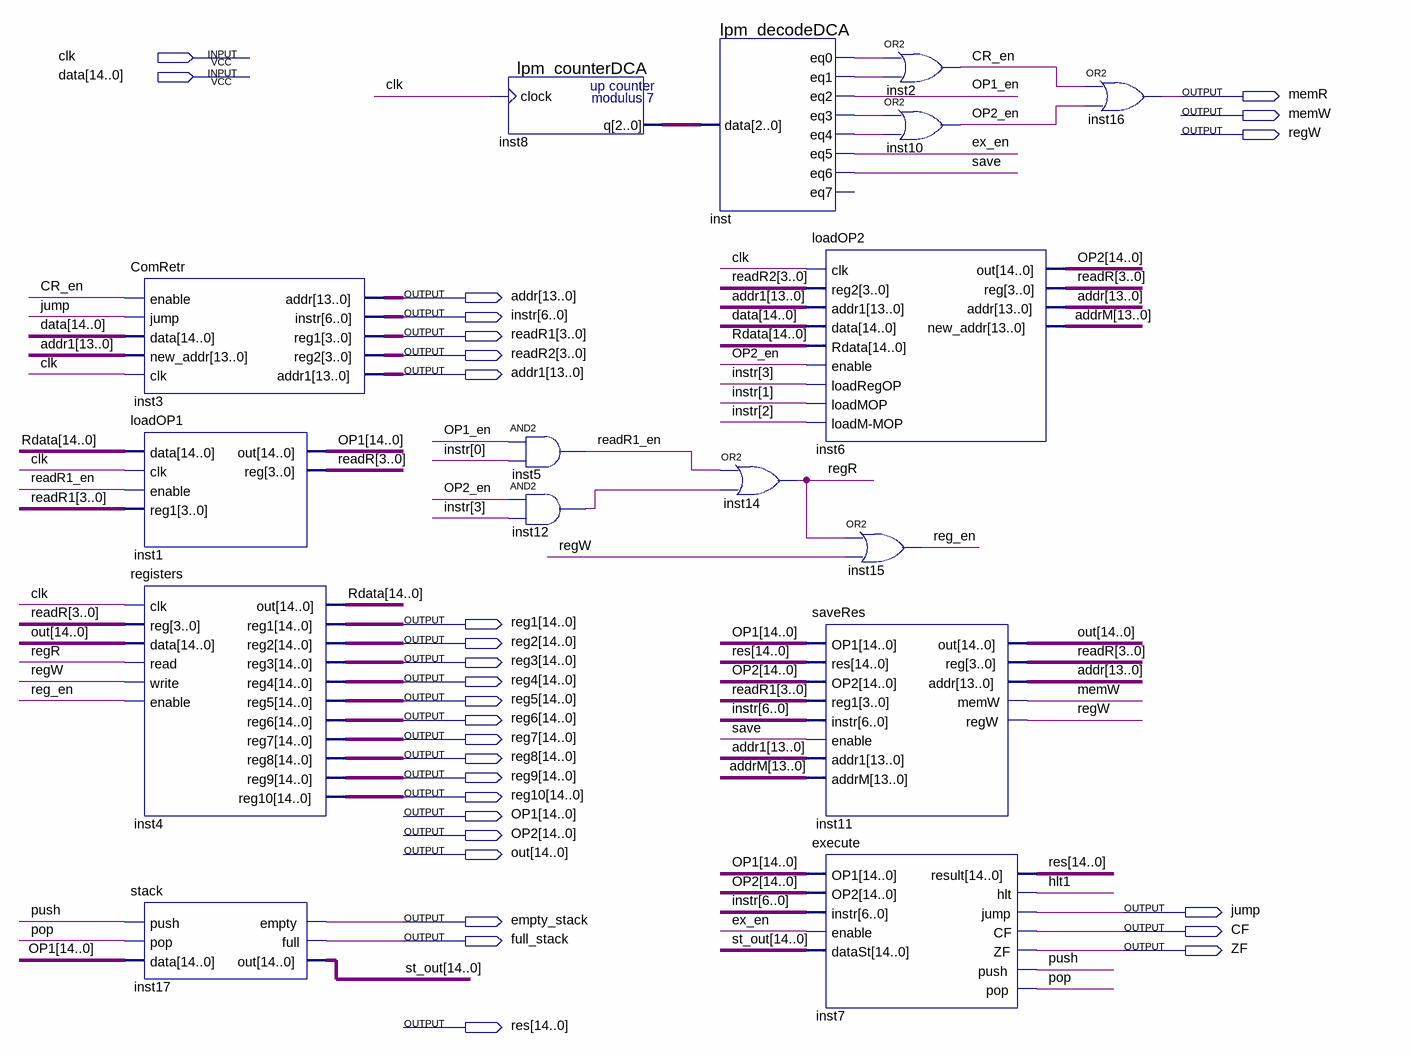
[diagram p0: schematic sheet]
// Quartus schematic cpu.bdf as structural Verilog: 16 symbols, 29 pins
module cpu (
  input  clk,
  input  [14:0] data,
  output memR,
  output memW,
  output regW,
  output [13:0] addr,
  output [6:0] instr,
  output [3:0] readR1,
  output [3:0] readR2,
  output [13:0] addr1,
  output [14:0] reg1,
  output [14:0] reg2,
  output [14:0] reg3,
  output [14:0] reg4,
  output [14:0] reg5,
  output [14:0] reg6,
  output [14:0] reg7,
  output [14:0] reg8,
  output [14:0] reg9,
  output [14:0] reg10,
  output [14:0] OP1,
  output [14:0] OP2,
  output [14:0] out,
  output jump,
  output empty_stack,
  output CF,
  output full_stack,
  output ZF,
  output [14:0] res
);

  wire CR_en, ex_en, hlt1, inst12_out, inst_eq0, inst_eq1, inst_eq3, inst_eq4, OP1_en, OP2_en, pop, push,
       readR1_en, reg_en, regR, save;
  wire [2:0] inst8_q;
  wire [3:0] readR;
  wire [13:0] addrM;
  wire [14:0] Rdata, st_out;

  ComRetr inst3 (
    .enable(CR_en), .jump(jump), .data(data), .new_addr(addr1), .clk(clk), .addr(addr), .instr(instr),
    .reg1(readR1), .reg2(readR2), .addr1(addr1));
  loadOP1 inst1 (.data(Rdata), .clk(clk), .enable(readR1_en), .reg1(readR1), .out(OP1), .\reg (readR));
  registers inst4 (
    .clk(clk), .\reg (readR), .data(out), .read(regR), .write(regW), .enable(reg_en), .out(Rdata),
    .reg1(reg1), .reg2(reg2), .reg3(reg3), .reg4(reg4), .reg5(reg5), .reg6(reg6), .reg7(reg7), .reg8(reg8),
    .reg9(reg9), .reg10(reg10));
  stack inst17 (.push(push), .pop(pop), .data(OP1), .empty(empty_stack), .full(full_stack), .out(st_out));
  lpm_counterDCA inst8 (.clock(clk), .q(inst8_q));
  and inst5 (readR1_en, OP1_en, instr[0]);
  and inst12 (inst12_out, OP2_en, instr[3]);
  lpm_decodeDCA inst (
    .data(inst8_q), .eq0(inst_eq0), .eq1(inst_eq1), .eq2(OP1_en), .eq3(inst_eq3), .eq4(inst_eq4),
    .eq5(ex_en), .eq6(save));  // open: eq7
  or inst14 (regR, readR1_en, inst12_out);
  loadOP2 inst6 (
    .clk(clk), .reg2(readR2), .addr1(addr1), .data(data), .Rdata(Rdata), .enable(OP2_en),
    .loadRegOP(instr[3]), .loadMOP(instr[1]), .\loadM-MOP (instr[2]), .out(OP2), .\reg (readR), .addr(addr),
    .new_addr(addrM));
  saveRes inst11 (
    .OP1(OP1), .res(res), .OP2(OP2), .reg1(readR1), .instr(instr), .enable(save), .addr1(addr1),
    .addrM(addrM), .out(out), .\reg (readR), .addr(addr), .memW(memW), .regW(regW));
  execute inst7 (
    .OP1(OP1), .OP2(OP2), .instr(instr), .enable(ex_en), .dataSt(st_out), .result(res), .hlt(hlt1),
    .jump(jump), .CF(CF), .ZF(ZF), .push(push), .pop(pop));
  or inst2 (CR_en, inst_eq0, inst_eq1);
  or inst10 (OP2_en, inst_eq3, inst_eq4);
  or inst15 (reg_en, regR, regW);
  or inst16 (memR, CR_en, OP2_en);
endmodule
